# EAGLE design MO-bela-lightspace-A (EAGLE 8.5.0)
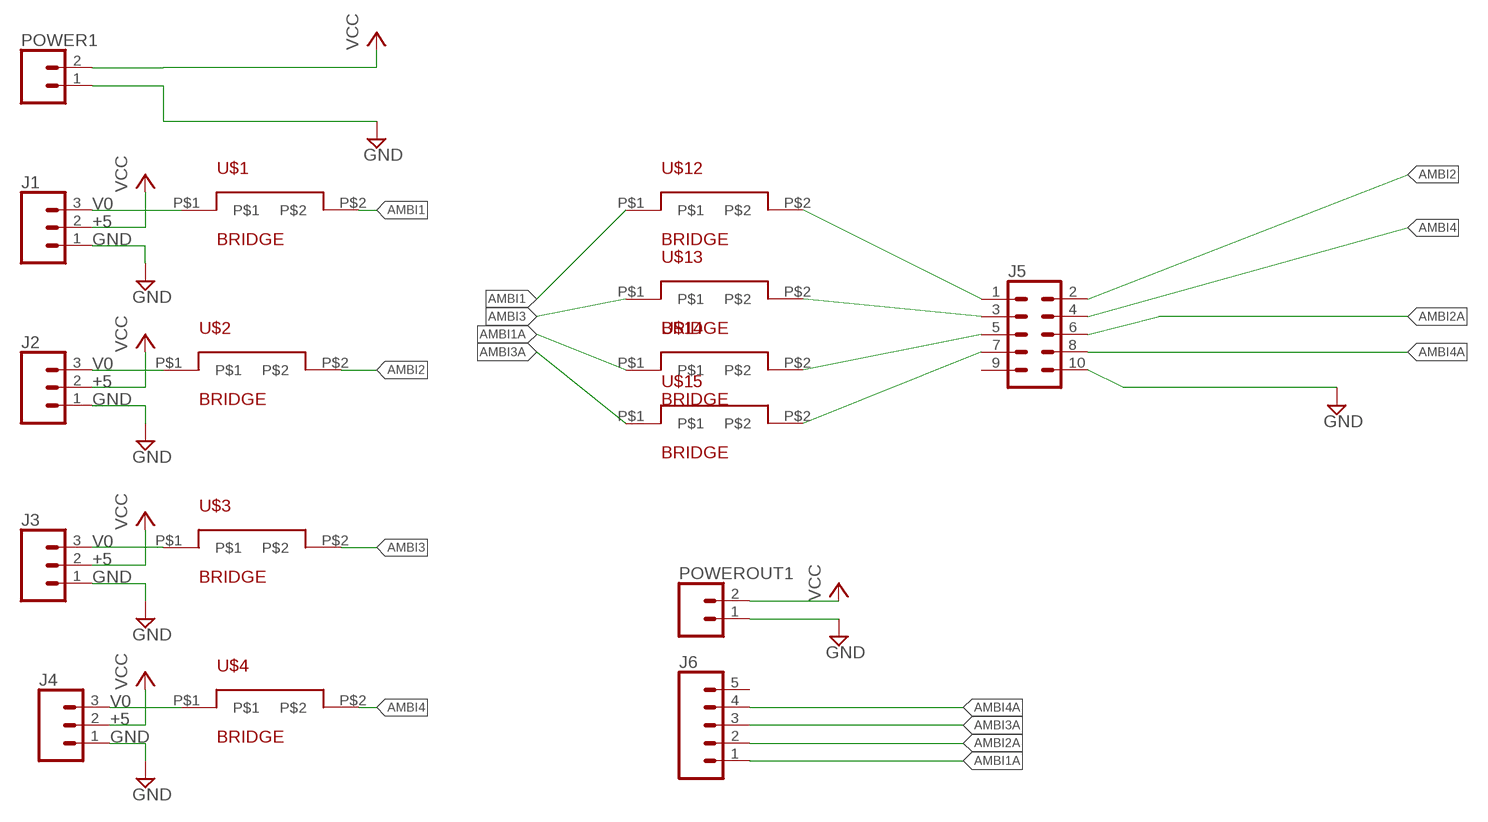
[diagram p0: schematic, sheet 1]

## Parts
J1  CONN_03LOCK  [1X03_LOCK]
J2  CONN_03LOCK  [1X03_LOCK]
J3  CONN_03LOCK  [1X03_LOCK]
J4  CONN_03LOCK  [1X03_LOCK]
J5  CONN_05X2SHD_LOCK  [2X5-SHROUDED_LOCK]
J6  CONN_05LOCK  [1X05_LOCK]
POWER1  CONN_02LOCK  [1X02_LOCK]
POWEROUT1  CONN_02LOCK  [1X02_LOCK]
U$1  BRIDGE  [BRIDGE]
U$2  BRIDGE  [BRIDGE]
U$3  BRIDGE  [BRIDGE]
U$4  BRIDGE  [BRIDGE]
U$12  BRIDGE  [BRIDGE]
U$13  BRIDGE  [BRIDGE]
U$14  BRIDGE  [BRIDGE]
U$15  BRIDGE  [BRIDGE]

## Nets
AMBI1: U$1.P$2 U$12.P$1
AMBI1A: J6.1 U$14.P$1
AMBI2: J5.2 U$2.P$2
AMBI2A: J5.6 J6.2
AMBI3: U$3.P$2 U$13.P$1
AMBI3A: J6.3 U$15.P$1
AMBI4: J5.4 U$4.P$2
AMBI4A: J5.8 J6.4
GND: J1.1 J2.1 J3.1 J4.1 J5.10 POWER1.1 POWEROUT1.1
N$1: J1.3 U$1.P$1
N$2: J2.3 U$2.P$1
N$3: J3.3 U$3.P$1
N$4: J4.3 U$4.P$1
N$8: J5.1 U$12.P$2
N$9: J5.3 U$13.P$2
N$10: J5.5 U$14.P$2
N$11: J5.7 U$15.P$2
VCC: J1.2 J2.2 J3.2 J4.2 POWER1.2 POWEROUT1.2
Unconnected: J5.9 J6.5

## Library data of the parts
J1-J4 = SparkFun-Connectors:CONN_03: Multi connection point. Often used as Generic Header-pin footprint for 0.1 inch spaced/style header connections On any of the 0.1 inch spaced packages, you can populate with these: Break Away Headers - Straight <https://www.sparkfun.com/products/116> (PRT-00116) Break Away Male Headers - Right Angle <https://www.sparkfun.com/products/553> (PRT-00553) Female Headers <https://www.sparkfun.com/products/115> (PRT-00115) Break Away Headers - Machine Pin <https://www.sparkfun.com/products/117> (PRT-00117) Break Away Female Headers - Swiss Machine Pin <https://www.sparkfun.com/products/743> (PRT-00743) Stackable Header - 3 Pin (Female, 0.1") <https://www.sparkfun.com/products/13875> (PRT-13875) For SCREWTERMINALS and SPRING TERMINALS visit here: Screw Terimnals on SparkFun.com <https://www.sparkfun.com/search/results?term=Screw+Terminals> (5mm/3.5mm/2.54mm spacing) This device is also useful as a general connection point to wire up your design to another part of your project. Our various solder wires solder well into these plated through hole pads. Hook-Up Wire - Assortment (Stranded, 22 AWG) <https://www.sparkfun.com/products/11375> (PRT-11375) Hook-Up Wire - Assortment (Solid Core, 22 AWG) <https://www.sparkfun.com/products/11367> (PRT-11367) View the entire wire category on our website here <https://www.sparkfun.com/categories/141> Special notes: Molex polarized connector foot print use with SKU : PRT-08232 with associated crimp pins and housings.; 5: +5; GND: GND; V0: V0
J5 = SparkFun-Connectors:CONN_05X2: Multi connection point. Often used as Generic Header-pin footprint for 0.1 inch spaced/style header connections For AVR SPI programming port, see special device with nice symbol: "AVR_SPI_PROG_5x2.dev" You can populate with any combo of single row headers, but if you'd like an exact match, check these: 2x5 AVR ICSP Male Header <https://www.sparkfun.com/products/778> (PRT-00778) 2x5 Pin Shrouded Header <https://www.sparkfun.com/products/8506> (PRT-08506) On any of the 0.1 inch spaced packages, you can populate with these: Break Away Headers - Straight <https://www.sparkfun.com/products/116> (PRT-00116) Break Away Male Headers - Right Angle <https://www.sparkfun.com/products/553> (PRT-00553) Female Headers <https://www.sparkfun.com/products/115> (PRT-00115) Break Away Headers - Machine Pin <https://www.sparkfun.com/products/117> (PRT-00117) Break Away Female Headers - Swiss Machine Pin <https://www.sparkfun.com/products/743> (PRT-00743) Special note: the shrouded connector mates well with our 5x2 ribbon cables: 2x5 Pin IDC Ribbon Cable <https://www.sparkfun.com/products/8535> (PRT-08535); PROD_ID: CONN-08671; SF_ID: PRT-08506
J6 = SparkFun-Connectors:CONN_05: Multi connection point. Often used as Generic Header-pin footprint for 0.1 inch spaced/style header connections On any of the 0.1 inch spaced packages, you can populate with these: Break Away Headers - Straight <https://www.sparkfun.com/products/116> (PRT-00116) Break Away Male Headers - Right Angle <https://www.sparkfun.com/products/553> (PRT-00553) Female Headers <https://www.sparkfun.com/products/115> (PRT-00115) Break Away Headers - Machine Pin <https://www.sparkfun.com/products/117> (PRT-00117) Break Away Female Headers - Swiss Machine Pin <https://www.sparkfun.com/products/743> (PRT-00743) For SCREWTERMINALS and SPRING TERMINALS visit here: Screw Terimnals on SparkFun.com <https://www.sparkfun.com/search/results?term=Screw+Terminals> (5mm/3.5mm/2.54mm spacing) This device is also useful as a general connection point to wire up your design to another part of your project. Our various solder wires solder well into these plated through hole pads. Hook-Up Wire - Assortment (Stranded, 22 AWG) <https://www.sparkfun.com/products/11375> (PRT-11375) Hook-Up Wire - Assortment (Solid Core, 22 AWG) <https://www.sparkfun.com/products/11367> (PRT-11367) View the entire wire category on our website here <https://www.sparkfun.com/categories/141> Special notes: Molex polarized connector foot print use with SKU : PRT-08231 with associated crimp pins and housings. 1MM SMD Version SKU: PRT-10208
POWER1 POWEROUT1 = SparkFun-Connectors:CONN_02: Multi connection point. Often used as Generic Header-pin footprint for 0.1 inch spaced/style header connections On any of the 0.1 inch spaced packages, you can populate with these: Break Away Headers - Straight <https://www.sparkfun.com/products/116> (PRT-00116) Break Away Male Headers - Right Angle <https://www.sparkfun.com/products/553> (PRT-00553) Female Headers <https://www.sparkfun.com/products/115> (PRT-00115) Break Away Headers - Machine Pin <https://www.sparkfun.com/products/117> (PRT-00117) Break Away Female Headers - Swiss Machine Pin <https://www.sparkfun.com/products/743> (PRT-00743) For SCREWTERMINALS and SPRING TERMINALS visit here: Screw Terimnals on SparkFun.com <https://www.sparkfun.com/search/results?term=Screw+Terminals> (5mm/3.5mm/2.54mm spacing) This device is also useful as a general connection point to wire up your design to another part of your project. Our various solder wires solder well into these plated through hole pads. Hook-Up Wire - Assortment (Stranded, 22 AWG) <https://www.sparkfun.com/products/11375> (PRT-11375) Hook-Up Wire - Assortment (Solid Core, 22 AWG) <https://www.sparkfun.com/products/11367> (PRT-11367) View the entire wire category on our website here <https://www.sparkfun.com/categories/141> Special notes: Molex polarized connector foot print use with: PRT-08233 with associated crimp pins and housings. 2.54_SCREWTERM for use with PRT-10571. 3.5mm Screw Terminal footprints for PRT-08084 5mm Screw Terminal footprints for use with PRT-08432
U$1-U$4 U$12-U$15 = CMU-ArtFab:BRIDGE

## Board
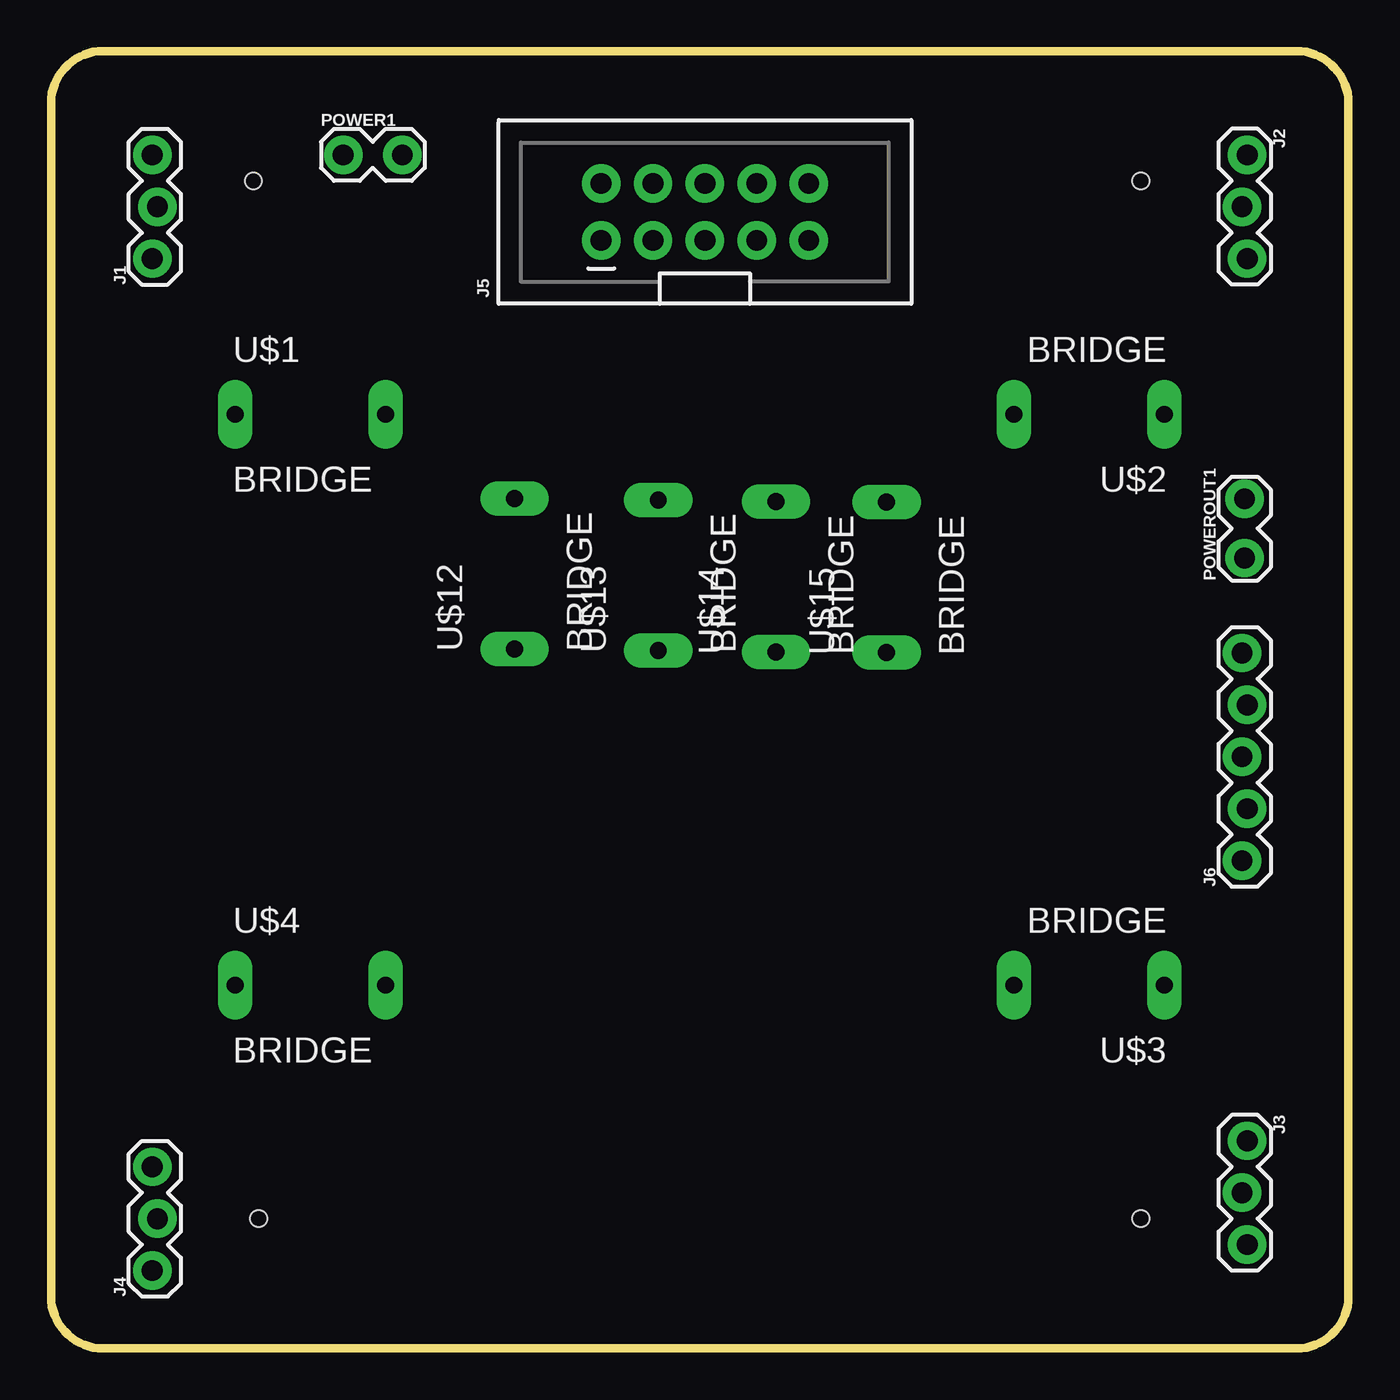
[diagram p1: board, top side]
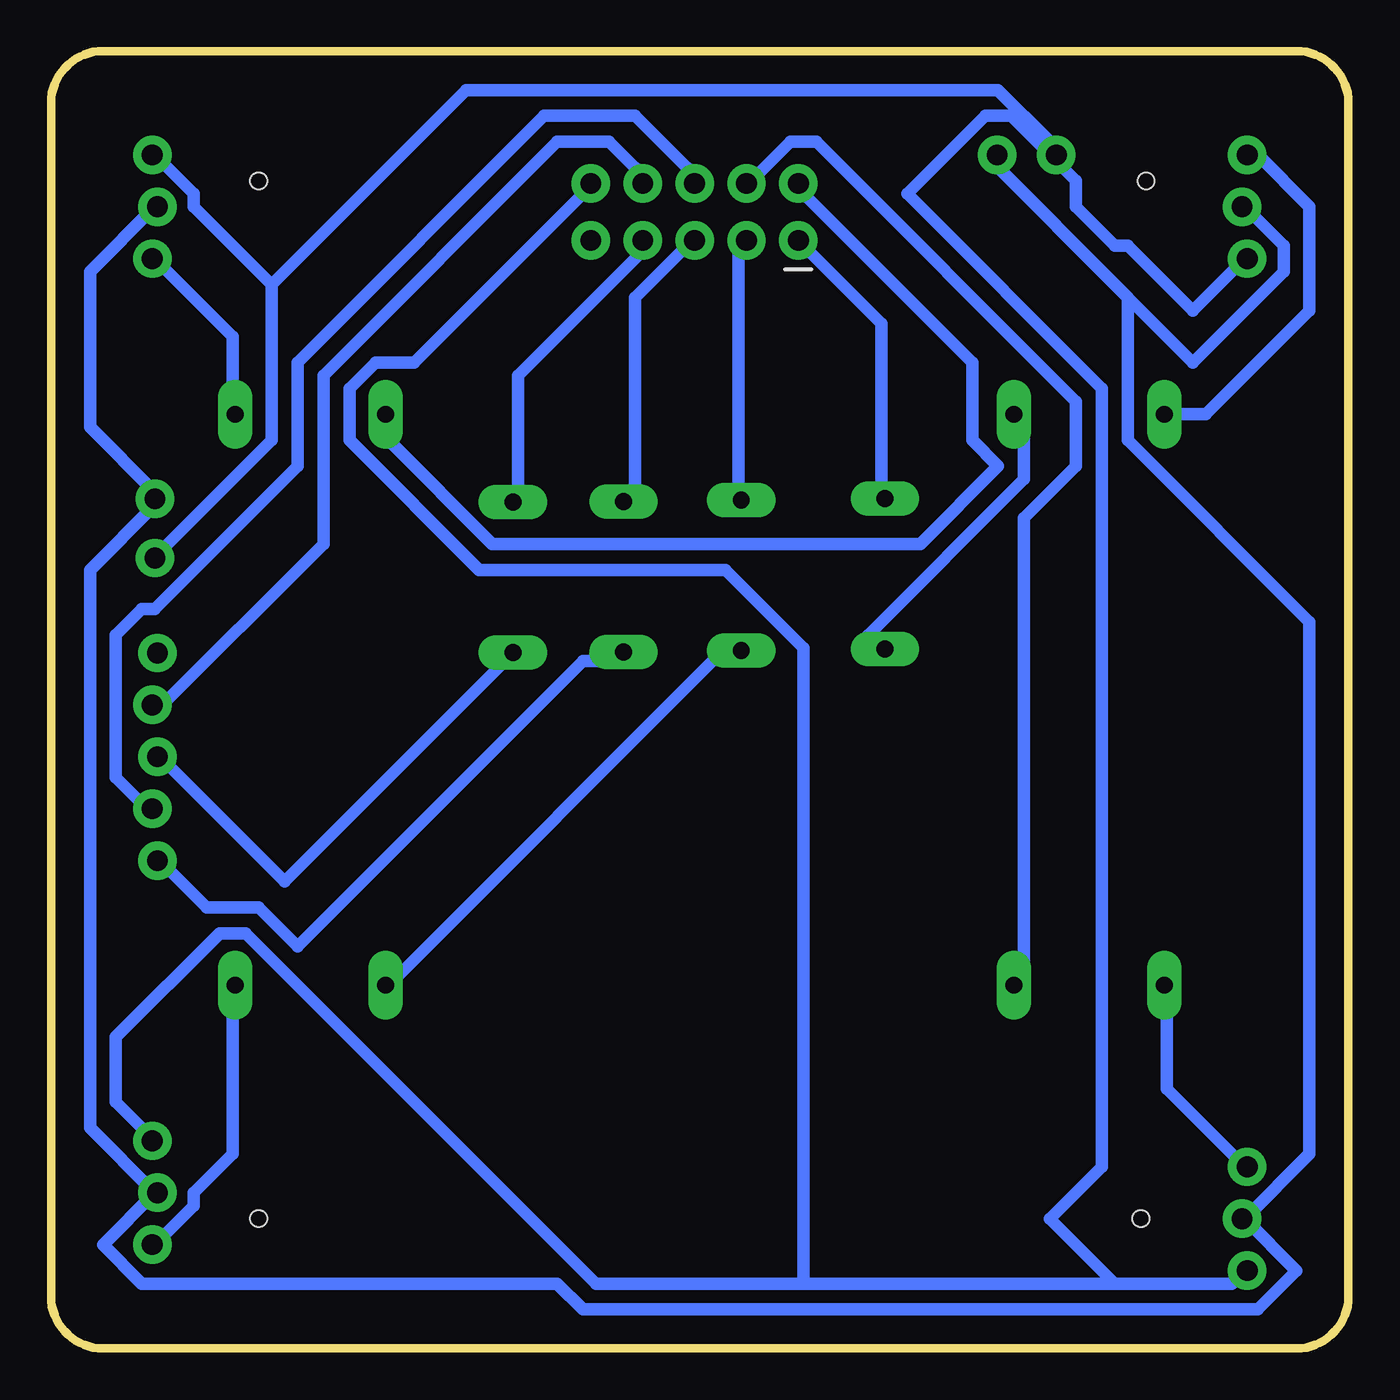
[diagram p2: board, bottom side, seen from below]

Size 63.5 x 63.5 mm. Coordinates in mm from the lower left corner, seen from the top.
Outline: 0,2.54 arc90 2.54,0 60.96,0 arc90 63.5,2.54 63.5,60.96 arc90 60.96,63.5 2.54,63.5 arc90 0,60.96 0,2.54
Copper layers (1*16): Top 0.035mm / dielectric 1.5mm / Bottom 0.035mm
Design rules "default *": minimum track width 24mil, minimum drill 0.35mm, track to track 16mil, track to pad 16mil, pad to pad 16mil, via to via 16mil, smd to smd 16mil, copper to edge 40mil, drill to drill 6mil, minimum pad ring 10mil, minimum via ring 8mil, stop-mask expansion 4mil, vias tented up to drill 0mil, thermal gap 10mil
Holes 0.81 mm at 10.16,6.35 53.34,6.35 9.91,57.15 53.34,57.15

### Footprints (pad centres in the part's own frame; a part is rotated, then mirrored left to right if it is on the bottom)
1X03_LOCK = drill 1.016 pad 1.88: 1 0,0.127; 2 2.54,-0.127; 3 5.08,0.127
2X5-SHROUDED_LOCK = drill 1.016 pad 1.88: 1 -1.397,5.08; 2 1.397,5.08; 3 -1.397,2.54; 4 1.397,2.54; 5 -1.397,0; 6 1.397,0; 7 -1.397,-2.54; 8 1.397,-2.54; 9 -1.397,-5.08; 10 1.397,-5.08
1X05_LOCK = drill 1.016 pad 1.88: 1 0,0.127; 2 2.54,-0.127; 3 5.08,0.127; 4 7.62,-0.127; 5 10.16,0.127
1X02_LOCK = drill 1.016 pad 1.88: 1 -0.178,0; 2 2.718,0
BRIDGE = drill 0.829 pad 1.676 long: P$1 -3.683,0; P$2 3.683,0

### Placement (x,y rotation side)
J1  5.08,53.34 90 top
J2  58.42,58.42 270 top
J3  58.42,10.16 270 top
J4  5.08,3.81 90 top
J5  32,55.63 90 top
J6  58.42,23.88 90 top
POWER1  14.48,58.42 0 top
POWEROUT1  58.42,38.86 90 top
U$1  12.7,45.72 0 top
U$2  50.8,45.72 180 top
U$3  50.8,17.78 180 top
U$4  12.7,17.78 0 top
U$12  22.68,37.92 90 top
U$13  29.72,37.85 90 top
U$14  35.48,37.77 90 top
U$15  40.89,37.74 90 top

### Tracks (layer width: path | path; a pad name or v marks a point on that pad's centre or on a via)
AMBI1
  Bottom 0.61: U$1.P$2 15.88,45.72 15.88,42.55 23.5,34.92 22.86,34.29 U$12.P$1
AMBI1A
  Bottom 0.61: U$14.P$1 35.56,33.66 37.47,33.66 51.44,19.68 53.34,21.59 55.88,21.59 57.78,23.5 J6.1
AMBI2
  Bottom 0.61: U$2.P$2 46.99,45.72 46.99,44.45 41.91,39.37 20.95,39.37 17.14,43.18 18.41,44.45 18.41,48.26 26.67,56.52 J5.2
AMBI2A
  Bottom 0.61: J5.6 32.38,57.15 32.38,57.78 34.92,60.33 39.37,60.33 51.44,48.26 51.44,43.18 58.42,36.2 59.05,36.2 60.33,34.92 60.33,27.94 59.05,26.67 J6.2
AMBI3
  Bottom 0.61: U$3.P$2 46.99,17.78 30.48,34.29 29.84,33.66 U$13.P$1
AMBI3A
  Bottom 0.61: U$15.P$1 41.27,33.66 52.07,22.86 57.78,28.57 J6.3
AMBI4
  Bottom 0.61: U$4.P$2 15.88,17.78 15.88,40.64 13.34,43.18 13.34,46.35 26.04,59.05 27.3,59.05 29.21,57.15 J5.4
AMBI4A
  Bottom 0.61: J5.8 34.92,57.15 34.92,57.78 36.2,59.05 38.73,59.05 50.16,47.62 50.16,39.37 58.42,31.11 J6.4
GND
  Bottom 0.61: 14.61,58.42 13.34,57.15 13.34,55.88 11.43,53.98 10.79,53.98 7.62,50.8 5.08,53.34 J1.1 | 52.7,52.07 52.7,44.45 58.42,38.73 POWEROUT1.1 | 52.7,52.07 56.52,55.88 56.52,56.52 58.42,58.42 J2.1 | 14.61,58.42 14.61,59.05 17.14,61.59 43.18,61.59 52.7,52.07 | 26.67,3.17 36.83,3.17 53.98,20.32 55.24,20.32 60.33,15.24 60.33,12.06 58.42,10.16 J3.1 | 26.67,3.17 11.43,3.17 | 11.43,3.17 5.71,3.17 5.08,3.81 J4.1 | 26.67,3.17 26.67,34.29 30.48,38.1 42.55,38.1 48.9,44.45 48.9,46.99 47.62,48.26 45.72,48.26 37.47,56.52 J5.10 | 14.61,58.42 16.51,60.33 17.78,60.33 21.59,56.52 12.06,46.99 12.06,8.89 14.61,6.35 11.43,3.17 | 14.61,58.42 POWER1.1
N$1
  Bottom 0.61: U$1.P$1 6.99,45.72 1.91,50.8 1.91,55.88 4.45,58.42 J1.3
N$2
  Bottom 0.61: U$2.P$1 54.61,45.72 54.61,49.53 58.42,53.34 J2.3
N$3
  Bottom 0.61: U$3.P$1 54.61,17.78 54.61,9.53 56.52,7.62 56.52,6.99 58.42,5.08 J3.3
N$4
  Bottom 0.61: U$4.P$1 8.89,17.78 8.89,12.7 5.08,8.89 J4.3
N$8
  Bottom 0.61: J5.1 22.86,50.16 22.86,41.91 U$12.P$2
N$9
  Bottom 0.61: U$13.P$2 29.84,41.91 29.84,53.98 J5.3
N$10
  Bottom 0.61: U$14.P$2 34.92,41.91 34.92,51.44 32.38,53.98 J5.5
N$11
  Bottom 0.61: U$15.P$2 40.64,41.91 40.64,47.62 34.29,53.98 J5.7
VCC
  Bottom 0.61: 58.42,7.62 61.59,10.79 61.59,38.1 58.42,41.27 POWEROUT1.2 58.42,41.91 61.59,45.09 61.59,52.7 58.42,55.88 J2.2 | 5.08,6.35 1.91,9.53 1.91,35.56 10.79,44.45 10.79,51.44 | 10.79,51.44 17.78,58.42 POWER1.2 | 10.79,51.44 7.62,48.26 3.17,52.7 3.17,53.98 5.08,55.88 J1.2 | 58.42,7.62 60.96,5.08 59.05,3.17 38.73,3.17 37.47,1.91 4.45,1.91 2.54,3.81 5.08,6.35 | 58.42,7.62 J3.2 | 5.08,6.35 J4.2